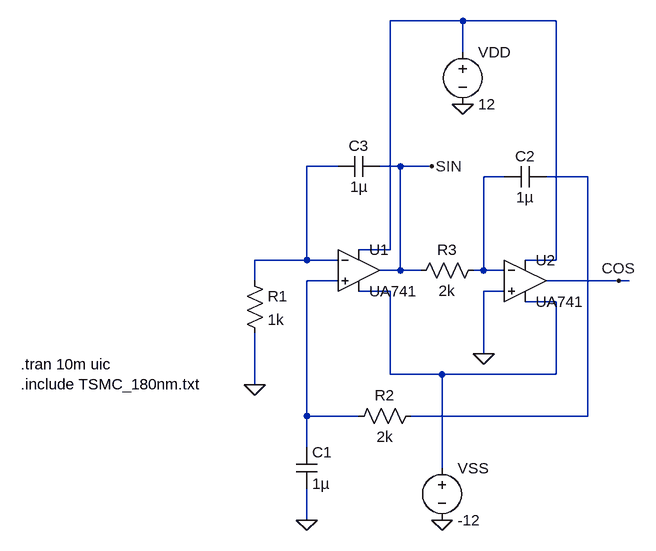
[diagram p0: schematic QA.asc]
QA.asc, the LTspice schematic file:
Version 4
SHEET 1 880 736
WIRE -848 -48 -960 -48
WIRE -704 -48 -848 -48
WIRE -848 0 -848 -48
WIRE -1040 176 -1088 176
WIRE -944 176 -976 176
WIRE -896 176 -944 176
WIRE -784 192 -816 192
WIRE -656 192 -720 192
WIRE -960 304 -960 -48
WIRE -960 304 -1008 304
WIRE -1088 320 -1088 176
WIRE -1088 320 -1168 320
WIRE -1040 320 -1088 320
WIRE -704 320 -704 -48
WIRE -704 320 -752 320
WIRE -944 336 -944 176
WIRE -944 336 -976 336
WIRE -912 336 -944 336
WIRE -816 336 -816 192
WIRE -816 336 -832 336
WIRE -784 336 -816 336
WIRE -1168 352 -1168 320
WIRE -1040 352 -1088 352
WIRE -608 352 -720 352
WIRE -592 352 -608 352
WIRE -960 368 -1008 368
WIRE -784 368 -816 368
WIRE -704 384 -752 384
WIRE -816 464 -816 368
WIRE -960 496 -960 368
WIRE -880 496 -960 496
WIRE -704 496 -704 384
WIRE -704 496 -880 496
WIRE -1168 512 -1168 432
WIRE -1088 560 -1088 352
WIRE -1008 560 -1088 560
WIRE -656 560 -656 192
WIRE -656 560 -928 560
WIRE -1088 608 -1088 560
WIRE -880 640 -880 496
WIRE -1088 720 -1088 672
FLAG -1168 512 0
FLAG -816 464 0
FLAG -608 352 COS
FLAG -896 176 SIN
FLAG -880 720 0
FLAG -848 80 0
FLAG -1088 720 0
SYMBOL res -1184 336 R0
SYMATTR InstName R1
SYMATTR Value 1k
SYMBOL res -912 544 R90
WINDOW 0 0 56 VBottom 2
WINDOW 3 32 56 VTop 2
SYMATTR InstName R2
SYMATTR Value 2k
SYMBOL cap -720 176 R90
WINDOW 0 0 32 VBottom 2
WINDOW 3 32 32 VTop 2
SYMATTR InstName C2
SYMATTR Value 1µ
SYMBOL cap -976 160 R90
WINDOW 0 0 32 VBottom 2
WINDOW 3 32 32 VTop 2
SYMATTR InstName C3
SYMATTR Value 1µ
SYMBOL res -816 320 R90
WINDOW 0 0 56 VBottom 2
WINDOW 3 32 56 VTop 2
SYMATTR InstName R3
SYMATTR Value 2k
SYMBOL voltage -848 -16 R0
SYMATTR InstName VDD
SYMATTR Value 12
SYMBOL voltage -880 624 R0
SYMATTR InstName VSS
SYMATTR Value -12
SYMBOL cap -1104 608 R0
SYMATTR InstName C1
SYMATTR Value 1µ
SYMBOL OpAmps/opamp2 -1008 272 R0
SYMATTR InstName U1
SYMATTR Value UA741
SYMBOL OpAmps/opamp2 -752 288 R0
SYMATTR InstName U2
SYMATTR Value UA741
TEXT -1528 480 Left 2 !.tran 10m uic\n.include TSMC_180nm.txt

The netlist it stands for:
* QA.asc
R1 N002 0 1k
R2 N004 N005 2k
C2 N004 N003 1µ
C3 SIN N002 1µ
R3 N003 SIN 2k
VDD N001 0 12
VSS N006 0 -12
C1 N005 0 1µ
XU1 N005 N002 N001 N006 SIN UA741  ; pins In+ In- V+ V- OUT
XU2 0 N003 N001 N006 COS UA741  ; pins In+ In- V+ V- OUT
.tran 10m uic
.include TSMC_180nm.txt
.backanno
.end